# Altium schematic sheet OpenPLCv0.2.0_TopLevel.SchDoc
size 420 x 297 mm; PageSetup: Record=PageOptions|CenterHorizontal=True|CenterVertical=True|PrintScale=1.01|XCorrection=1.00|YCorrection=1.00|PrintKind=1|BorderSize=5000000|LeftOffset=0|BottomOffset=0|Orientation=2|PaperLength=1000|PaperWidth=1000|Scale=100|PaperSource=7|PrintQuality=-4|MediaType=1|DitherType=10|PaperKind=A3|PrintScaleMode=1; Author: Callum Nunes-Vaz; DocumentNumber: 1; SheetNumber: 1; SheetTotal: 22; SheetTitle: Top Level
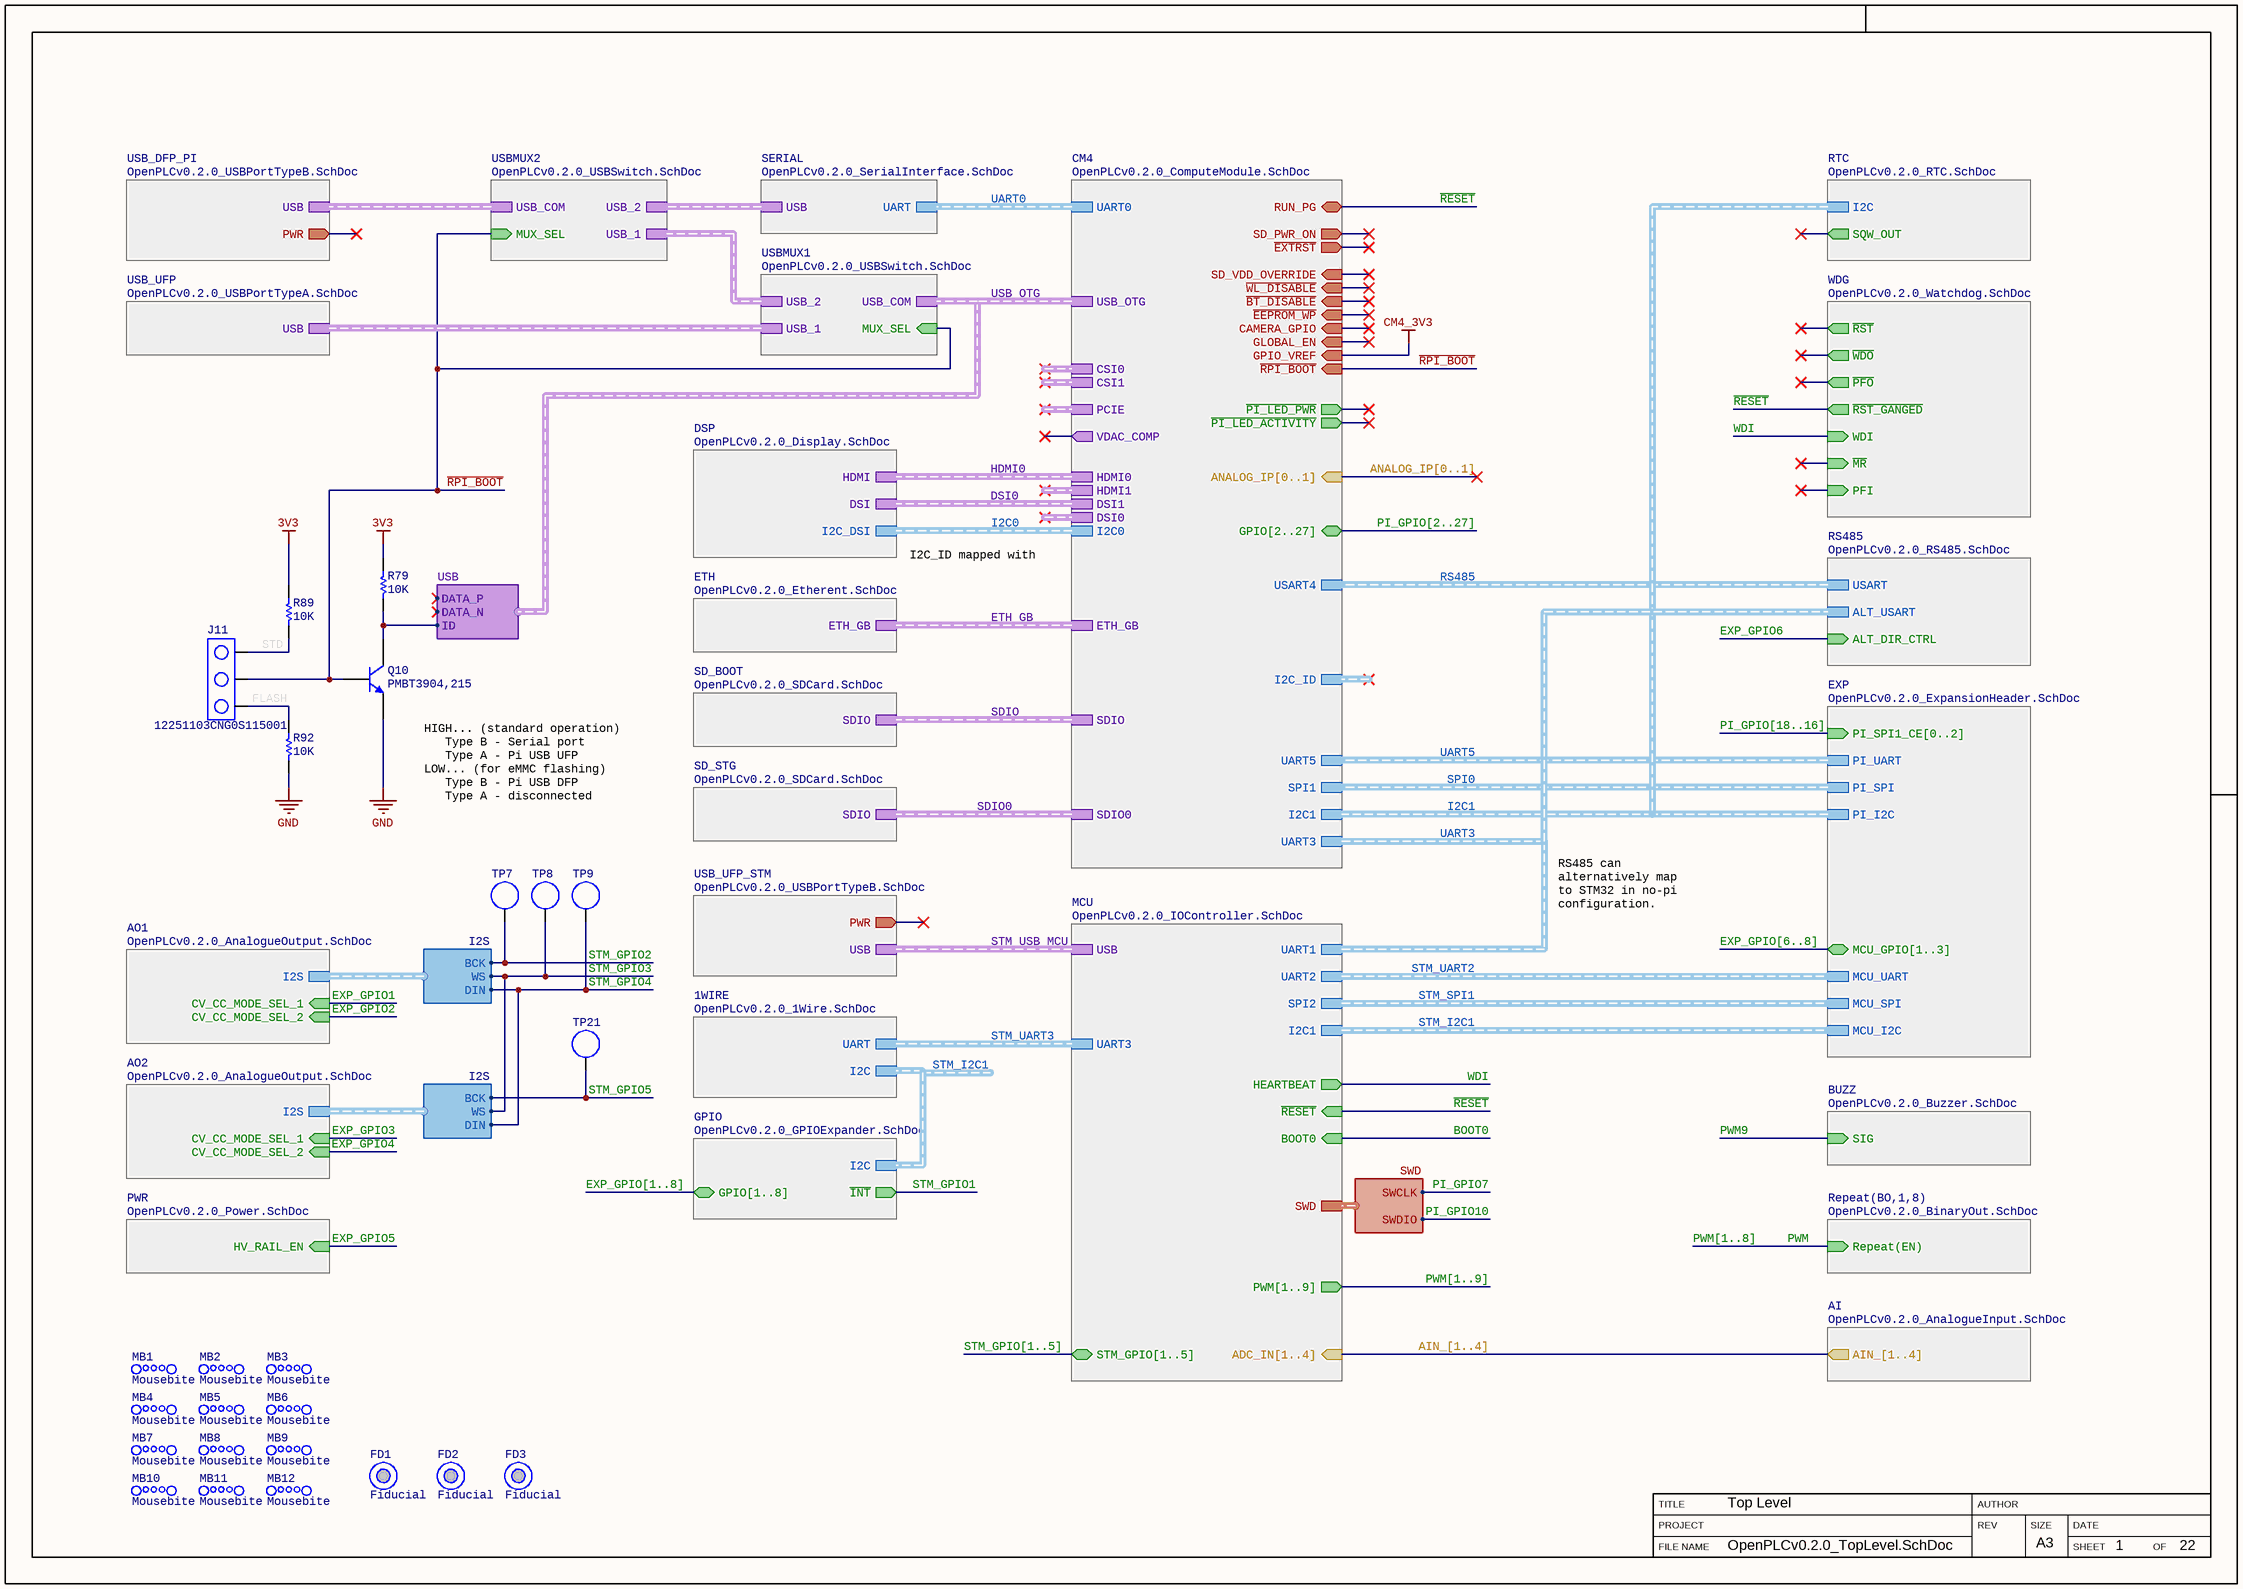
[diagram p0: OpenPLCv0.2.0_TopLevel.SchDoc]

## Parts
FD1  Fiducial  [Fiducial]
FD2  Fiducial  [Fiducial]
FD3  Fiducial  [Fiducial]
J11  12251103CNG0S115001  [Header_3POS]
MB1  Mousebite  [MOUSEBITE]  (no BOM)
MB2  Mousebite  [MOUSEBITE]  (no BOM)
MB3  Mousebite  [MOUSEBITE]  (no BOM)
MB4  Mousebite  [MOUSEBITE]  (no BOM)
MB5  Mousebite  [MOUSEBITE]  (no BOM)
MB6  Mousebite  [MOUSEBITE]  (no BOM)
MB7  Mousebite  [MOUSEBITE]  (no BOM)
MB8  Mousebite  [MOUSEBITE]  (no BOM)
MB9  Mousebite  [MOUSEBITE]  (no BOM)
MB10  Mousebite  [MOUSEBITE]  (no BOM)
MB11  Mousebite  [MOUSEBITE]  (no BOM)
MB12  Mousebite  [MOUSEBITE]  (no BOM)
Q10  PMBT3904,215  [SOT23-3]
R79  Resistance: 10K  [SMD_RES_0402(1005)_N]  (hidden comment: RC0402FR-0710KL)
R89  Resistance: 10K  [SMD_RES_0402(1005)_N]  (hidden comment: RC0402FR-0710KL)
R92  Resistance: 10K  [SMD_RES_0402(1005)_N]  (hidden comment: RC0402FR-0710KL)
TP7  TestPoint  [Pad]  (value not drawn)  (no BOM)
TP8  TestPoint  [Pad]  (value not drawn)  (no BOM)
TP9  TestPoint  [Pad]  (value not drawn)  (no BOM)
TP21  TestPoint  [Pad]  (value not drawn)  (no BOM)

## Sub-sheets
1WIRE = OpenPLCv0.2.0_1Wire.SchDoc: I2C (harness I2C), UART (harness UART)
AI = OpenPLCv0.2.0_AnalogueInput.SchDoc: AIN_[1..4] (out)
AO1 = OpenPLCv0.2.0_AnalogueOutput.SchDoc: CV_CC_MODE_SEL_1 (in), I2S (harness I2S), CV_CC_MODE_SEL_2 (in)
AO2 = OpenPLCv0.2.0_AnalogueOutput.SchDoc: CV_CC_MODE_SEL_1 (in), I2S (harness I2S), CV_CC_MODE_SEL_2 (in)
BUZZ = OpenPLCv0.2.0_Buzzer.SchDoc: SIG (in)
CM4 = OpenPLCv0.2.0_ComputeModule.SchDoc: USB_OTG (harness USB), I2C1 (harness I2C), VDAC_COMP (out), PCIE (harness PCIE), CSI1 (harness MIPI_CSI_4L), CSI0 (harness MIPI_CSI_2L), HDMI0 (harness HDMI), SDIO (harness SDIO_X8), HDMI1 (harness HDMI), ETH_GB (harness ETH_GP), I2C_ID (harness I2C), UART0 (harness UART), UART3 (harness UART), I2C0 (harness I2C), SDIO0 (harness SDIO_X8), UART5 (harness UART), SPI1 (harness SPI), USART4 (harness USART), DSI1 (harness MIPI_DSI_4L), DSI0 (harness MIPI_DSI_2L), RUN_PG (bidir), SD_PWR_ON (out), ~{EXTRST} (out), GLOBAL_EN (in), ~{RPI_BOOT} (in), CAMERA_GPIO (in), ~{WL_DISABLE} (in), ~{EEPROM_WP} (in), ~{BT_DISABLE} (in), SD_VDD_OVERRIDE (in), GPIO_VREF (in), ~{PI_LED_PWR} (out), ~{PI_LED_ACTIVITY} (out), ANALOG_IP[0..1] (in), GPIO[2..27] (bidir)
DSP = OpenPLCv0.2.0_Display.SchDoc: I2C_DSI (harness I2C), HDMI (harness HDMI), DSI (harness MIPI_DSI_4L)
ETH = OpenPLCv0.2.0_Etherent.SchDoc: ETH_GB (harness ETH_GP)
EXP = OpenPLCv0.2.0_ExpansionHeader.SchDoc: MCU_I2C (harness I2C), MCU_UART (harness UART), MCU_SPI (harness SPI), PI_SPI1_CE[0..2] (in), PI_I2C (harness I2C), PI_UART (harness UART), PI_SPI (harness SPI), MCU_GPIO[1..3] (bidir)
GPIO = OpenPLCv0.2.0_GPIOExpander.SchDoc: I2C (harness I2C), GPIO[1..8] (bidir), ~{INT} (out)
MCU = OpenPLCv0.2.0_IOController.SchDoc: ADC_IN[1..4] (in), STM_GPIO[1..5] (bidir), UART1 (harness UART), UART2 (harness UART), SPI2 (harness SPI), SWD (harness SWD), PWM[1..9] (out), BOOT0 (in), USB (harness USB), UART3 (harness UART), I2C1 (harness I2C), ~{RESET} (in), HEARTBEAT (out)
PWR = OpenPLCv0.2.0_Power.SchDoc: HV_RAIL_EN (in)
Repeat(BO,1,8) = OpenPLCv0.2.0_BinaryOut.SchDoc: Repeat(EN) (in)
RS485 = OpenPLCv0.2.0_RS485.SchDoc: USART (harness USART), ALT_USART (harness USART), ALT_DIR_CTRL (in)
RTC = OpenPLCv0.2.0_RTC.SchDoc: SQW_OUT (out), I2C (harness I2C)
SD_BOOT = OpenPLCv0.2.0_SDCard.SchDoc: SDIO (harness SDIO_X8)
SD_STG = OpenPLCv0.2.0_SDCard.SchDoc: SDIO (harness SDIO_X8)
SERIAL = OpenPLCv0.2.0_SerialInterface.SchDoc: UART (harness UART), USB (harness USB)
USB_DFP_PI = OpenPLCv0.2.0_USBPortTypeB.SchDoc: USB (harness USB), PWR (out)
USB_UFP = OpenPLCv0.2.0_USBPortTypeA.SchDoc: USB (harness USB)
USB_UFP_STM = OpenPLCv0.2.0_USBPortTypeB.SchDoc: USB (harness USB), PWR (out)
USBMUX1 = OpenPLCv0.2.0_USBSwitch.SchDoc: USB_COM (harness USB), USB_1 (harness USB), USB_2 (harness USB), MUX_SEL (in)
USBMUX2 = OpenPLCv0.2.0_USBSwitch.SchDoc: USB_COM (harness USB), USB_1 (harness USB), USB_2 (harness USB), MUX_SEL (in)
WDG = OpenPLCv0.2.0_Watchdog.SchDoc: PFI (in), ~{MR} (in), WDI (in), ~{PFO} (out), ~{WDO} (out), ~{RST} (out), ~{RST_GANGED} (out)

## Harnesses
SWD: SWCLK, SWDIO
I2S: WS, BCK, DIN
USB: DATA_P, DATA_N, ID

## Nets
3V3: R79.1 R89.2
CM4_3V3: sheet CM4/GPIO_VREF
GND: Q10.2(E) R92.1
BOOT0: sheet MCU/BOOT0
EXP_GPIO1: sheet AO1/CV_CC_MODE_SEL_1
EXP_GPIO2: sheet AO1/CV_CC_MODE_SEL_2
EXP_GPIO3: sheet AO2/CV_CC_MODE_SEL_1
EXP_GPIO4: sheet AO2/CV_CC_MODE_SEL_2
EXP_GPIO5: sheet PWR/HV_RAIL_EN
EXP_GPIO6: sheet RS485/ALT_DIR_CTRL
FLASH: J11.3 R92.2
PI_GPIO7: sheet MCU/SWD.SWCLK
PI_GPIO10: sheet MCU/SWD.SWDIO
PWM: sheet Repeat(BO,1,8)/Repeat(EN)
PWM9: sheet BUZZ/SIG
~{RESET}: sheet CM4/RUN_PG, sheet MCU/~{RESET}, sheet WDG/~{RST_GANGED}
~{RPI_BOOT}: J11.2 Q10.1(B) ; sheet CM4/~{RPI_BOOT}, sheet USBMUX1/MUX_SEL, sheet USBMUX2/MUX_SEL
STD: J11.1 R89.1
STM_GPIO1: sheet GPIO/~{INT}
STM_GPIO2: TP7.1 ; sheet AO1/I2S.BCK
STM_GPIO3: TP8.1 ; sheet AO2/I2S.WS, sheet AO1/I2S.WS
STM_GPIO4: TP9.1 ; sheet AO2/I2S.DIN, sheet AO1/I2S.DIN
STM_GPIO5: TP21.1 ; sheet AO2/I2S.BCK
USB_OTG.ID: Q10.3(C) R79.2 ; sheet CM4/USB_OTG.ID
WDI: sheet MCU/HEARTBEAT, sheet WDG/WDI

## Buses and harness runs
bus AIN_[1..4] = sheet AI/AIN_[1..4] = sheet MCU/ADC_IN[1..4]
bus ANALOG_IP[0..1] = sheet CM4/ANALOG_IP[0..1]
bus EXP_GPIO[1..8] = sheet GPIO/GPIO[1..8]
bus EXP_GPIO[6..8] = sheet EXP/MCU_GPIO[1..3]
bus PI_GPIO[2..27] = sheet CM4/GPIO[2..27]
bus PI_GPIO[18..16] = sheet EXP/PI_SPI1_CE[0..2]
bus PWM[1..8]
bus PWM[1..9] = sheet MCU/PWM[1..9]
bus STM_GPIO[1..5] = sheet MCU/STM_GPIO[1..5]
harness DSI0 = sheet CM4/DSI1 = sheet DSP/DSI
harness ETH_GB = sheet CM4/ETH_GB = sheet ETH/ETH_GB
harness HDMI0 = sheet CM4/HDMI0 = sheet DSP/HDMI
harness I2C0 = sheet CM4/I2C0 = sheet DSP/I2C_DSI
harness I2C1 = sheet CM4/I2C1 = sheet EXP/PI_I2C = sheet RTC/I2C
harness RS485 = sheet CM4/USART4 = sheet RS485/USART
harness SDIO0 = sheet CM4/SDIO0 = sheet SD_STG/SDIO
harness SDIO = sheet CM4/SDIO = sheet SD_BOOT/SDIO
harness sheet SERIAL/USB = sheet USBMUX2/USB_2
harness sheet USB_DFP_PI/USB = sheet USBMUX2/USB_COM
harness sheet USB_UFP/USB = sheet USBMUX1/USB_1
harness sheet USBMUX1/USB_2 = sheet USBMUX2/USB_1
harness SPI0 = sheet CM4/SPI1 = sheet EXP/PI_SPI
harness STM_I2C1 = sheet 1WIRE/I2C = sheet GPIO/I2C
harness STM_I2C1 = sheet EXP/MCU_I2C = sheet MCU/I2C1
harness STM_SPI1 = sheet EXP/MCU_SPI = sheet MCU/SPI2
harness STM_UART2 = sheet EXP/MCU_UART = sheet MCU/UART2
harness STM_UART3 = sheet 1WIRE/UART = sheet MCU/UART3
harness STM_USB_MCU = sheet MCU/USB = sheet USB_UFP_STM/USB
harness UART0 = sheet CM4/UART0 = sheet SERIAL/UART
harness UART3 = sheet CM4/UART3 = sheet MCU/UART1 = sheet RS485/ALT_USART
harness UART5 = sheet CM4/UART5 = sheet EXP/PI_UART
harness USB_OTG = sheet CM4/USB_OTG = sheet USBMUX1/USB_COM

## Notes on the sheet
- I2C_ID mapped with DSI1
- (near Q10) HIGH... (standard operation)
  Type B - Serial port
  Type A - Pi USB UFP
  LOW... (for eMMC flashing)
  Type B - Pi USB DFP
  Type A - disconnected
- RS485 can alternatively map to STM32 in no-pi configuration.
- FILE NAME
- PROJECT
- TITLE
- REV
- AUTHOR
- SIZE
- SHEET
- DATE
- OF
- A3

## Library data of the parts
J11 = 3-way Jumper: Pin Header 3 1 right-angle，180degrees 2.54mm Through Hole,P=2.54mm Pin Header & Female Header RoHS
Q10 = PMBT3904,215: NPN 200mA 40V 250mW SOT-23(SOT-23-3) Transistors (NPN/PNP) RoHS
R79 R89 R92 = 10K 0402 1% 1/16W: 10kΩ ±1% 1/16W ±100ppm/℃ 0402 Chip Resistor - Surface Mount RoHS; Package: 0402; Tolerance: 1%; Power Rating: 1/16W
TP7-TP9 TP21 = Test point